# EAGLE schematic M869D (EAGLE 6.6.0)

## Sheet 1 of 2
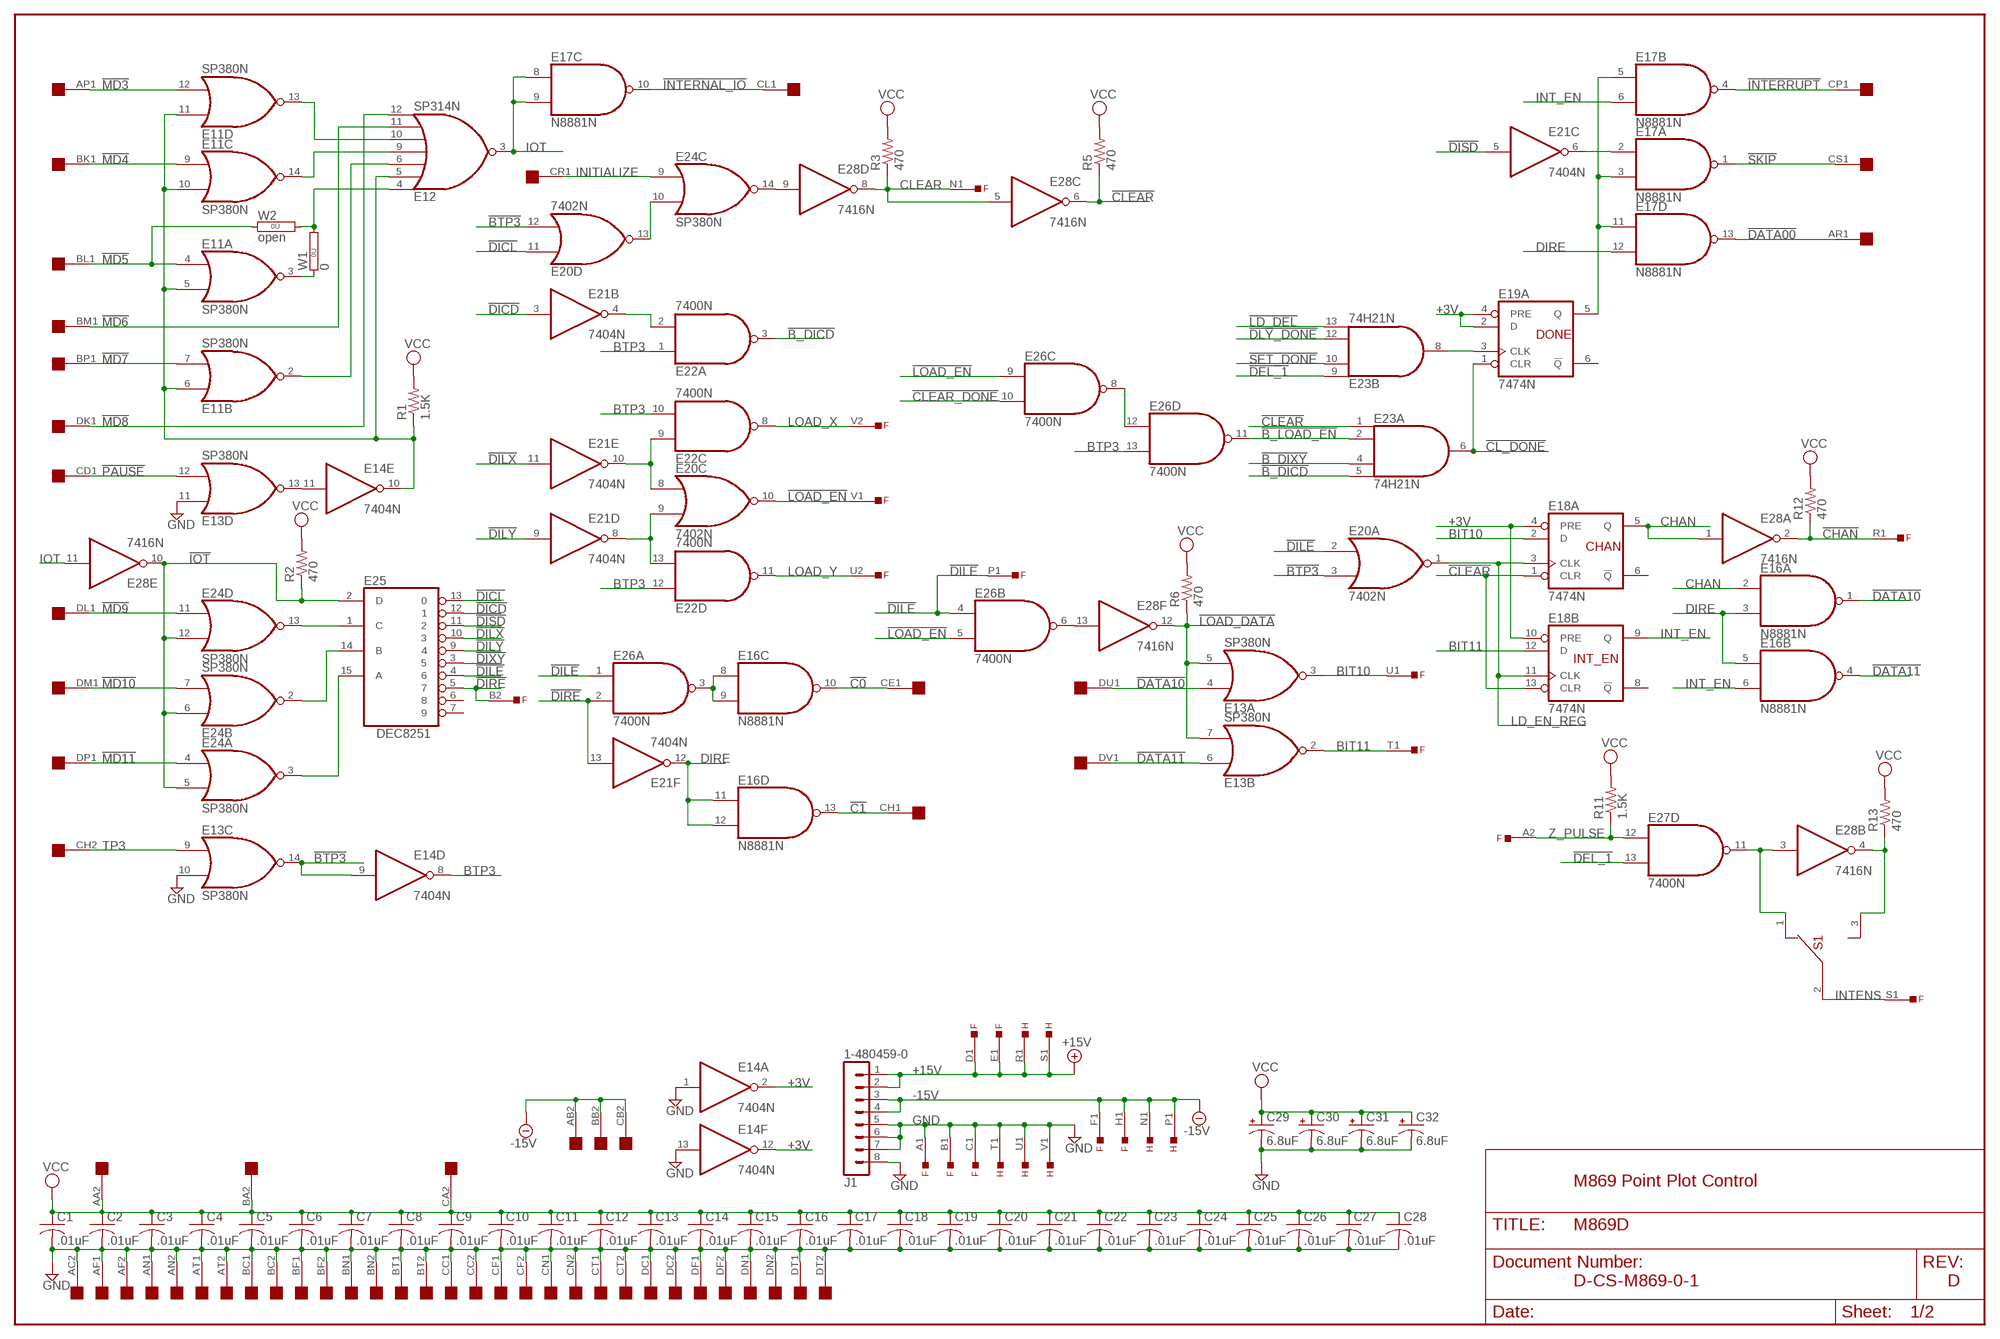
[diagram p0: schematic, sheet 1]

### Parts
C1  .01uF  C-US  [C063-025X075]
C2  .01uF  C-US  [C063-025X075]
C3  .01uF  C-US  [C063-025X075]
C4  .01uF  C-US  [C063-025X075]
C5  .01uF  C-US  [C063-025X075]
C6  .01uF  C-US  [C063-025X075]
C7  .01uF  C-US  [C063-025X075]
C8  .01uF  C-US  [C063-025X075]
C9  .01uF  C-US  [C063-025X075]
C10  .01uF  C-US  [C063-025X075]
C11  .01uF  C-US  [C063-025X075]
C12  .01uF  C-US  [C063-025X075]
C13  .01uF  C-US  [C063-025X075]
C14  .01uF  C-US  [C063-025X075]
C15  .01uF  C-US  [C063-025X075]
C16  .01uF  C-US  [C063-025X075]
C17  .01uF  C-US  [C063-025X075]
C18  .01uF  C-US  [C063-025X075]
C19  .01uF  C-US  [C063-025X075]
C20  .01uF  C-US  [C063-025X075]
C21  .01uF  C-US  [C063-025X075]
C22  .01uF  C-US  [C063-025X075]
C23  .01uF  C-US  [C063-025X075]
C24  .01uF  C-US  [C063-025X075]
C25  .01uF  C-US  [C063-025X075]
C26  .01uF  C-US  [C063-025X075]
C27  .01uF  C-US  [C063-025X075]
C28  .01uF  C-US  [C063-025X075]
C29  6.8uF  CPOL-USE20-8AXIAL  [E12-8]
C30  6.8uF  CPOL-USE20-8AXIAL  [E12-8]
C31  6.8uF  CPOL-USE20-8AXIAL  [E12-8]
C32  6.8uF  CPOL-USE20-8AXIAL  [E12-8]
E11  SP380N  [DIL14]
E12  SP314N  [DIL14]
E13  SP380N  [DIL14]
E14  7404N  [DIL14]
E16  N8881N  [DIL14]
E17  N8881N  [DIL14]
E18  7474N  74S74N  [DIL14]
E19  7474N  74S74N  [DIL14]
E20  7402N  [DIL14]
E21  7404N  [DIL14]
E22  7400N  [DIL14]
E23  74H21N  74LS21N  [DIL14]
E24  SP380N  [DIL14]
E25  DEC8251  [DIL16]
E26  7400N  [DIL14]
E27  7400N  [DIL14]
E28  7416N  [DIL14]
F  EDGE-TOP  [EDGE-CON2]
H  EDGE-TOP  [EDGE-CON2]
J1  1-480459-0  [1-480459-0]
OMNIBUS  QUAD  [EDGE-CON8]
R1  1.5K  R-US_0207/10  [0207/10]
R2  470  R-US_0207/10  [0207/10]
R3  470  R-US_0207/10  [0207/10]
R5  470  R-US_0207/10  [0207/10]
R6  470  R-US_0207/10  [0207/10]
R11  1.5K  R-US_0207/10  [0207/10]
R12  470  R-US_0207/10  [0207/10]
R13  470  R-US_0207/10  [0207/10]
S1  12-09698  [23-021]
W1  0  0R  [0R/10]
W2  open  0R  [0R/10]

### Nets
!B_DICD: E22.3(A:O) E23.5(A:I3)
!B_DIXY: E23.4(A:I2) ; also sheet 2
!B_LOAD_EN: E23.2(A:I1) E26.11(D:O)
!BTP3: E13.14(C:O) E14.9(D:I) E20.3(A:I1) E20.12(D:I1)
!C0: E16.10(C:O) OMNIBUS.CE1
!C1: E16.13(D:O) OMNIBUS.CH1
!CHAN: E28.2(A:O) F.R1 R12.1
!CL_DONE: E19.1(A:CLR) E23.6(A:O)
!CLEAR: E18.1(A:CLR) E18.13(B:CLR) E23.1(A:I0) E28.6(C:O) R5.1 ; also sheet 2
!CLEAR_DONE: E26.10(C:I1) ; also sheet 2
!DATA00: E17.13(D:O) OMNIBUS.AR1
!DATA10: E13.4(A:I0) E16.1(A:O) OMNIBUS.DU1
!DATA11: E13.6(B:I0) E16.4(B:O) OMNIBUS.DV1
!DEL_1: E23.9(B:I0) E27.13(D:I1) ; also sheet 2
!DICD: E21.3(B:I) E25.12
!DICL: E20.11(D:I0) E25.13
!DILE: E20.2(A:I0) E25.4 E26.1(A:I0) E26.4(B:I0) F.P1
!DILX: E21.11(E:I) E25.10
!DILY: E21.9(D:I) E25.9
!DIRE: E21.13(F:I) E25.5 E26.2(A:I1) F.B2
!DISD: E21.5(C:I) E25.11
!DIXY: E25.3 ; also sheet 2
!DLY_DONE: E23.12(B:I2) ; also sheet 2
!INTERNAL_IO: E17.10(C:O) OMNIBUS.CL1
!INTERRUPT: E17.4(B:O) OMNIBUS.CP1
!IOT: E24.5(A:I1) E24.6(B:I0) E24.12(D:I1) E25.2(D) E28.10(E:O) R2.1
!LD_DEL: E23.13(B:I3) ; also sheet 2
!LOAD_DATA: E13.5(A:I1) E13.7(B:I1) E28.12(F:O) R6.1 ; also sheet 2
!LOAD_EN: E20.10(C:O) E26.5(B:I1) E26.9(C:I0) F.V1 ; also sheet 2
!MD3: E11.12(D:I1) OMNIBUS.AP1
!MD4: E11.9(C:I0) OMNIBUS.BK1
!MD5: E11.4(A:I0) OMNIBUS.BL1 W2.1
!MD6: E12.11(I5) OMNIBUS.BM1
!MD7: E11.7(B:I1) OMNIBUS.BP1
!MD8: E12.12(I6) OMNIBUS.DK1
!MD9: E24.11(D:I0) OMNIBUS.DL1
!MD10: E24.7(B:I1) OMNIBUS.DM1
!MD11: E24.4(A:I0) OMNIBUS.DP1
!PAUSE: E13.12(D:I1) OMNIBUS.CD1
!SET_DONE: E23.10(B:I1) ; also sheet 2
!SKIP: E17.1(A:O) OMNIBUS.CS1
+3V: E14.2(A:O) E14.12(F:O) E18.4(A:PRE) E18.10(B:PRE) E19.2(A:D) E19.4(A:PRE) ; also sheet 2
+15V: F.D1 F.E1 H.R1 H.S1 J1.1 J1.2
-15V [supply]: F.F1 F.H1 H.N1 H.P1 J1.3 J1.4 OMNIBUS.AB2 OMNIBUS.BB2 OMNIBUS.CB2
BIT10: E13.3(A:O) E18.2(A:D) F.U1
BIT11: E13.2(B:O) E18.12(B:D) F.T1
BTP3: E14.8(D:O) E22.1(A:I0) E22.10(C:I1) E22.12(D:I0) E26.13(D:I1) ; also sheet 2
CHAN: E16.2(A:I0) E18.5(A:Q) E28.1(A:I)
CLEAR: E28.5(C:I) E28.8(D:O) F.N1 R3.1 ; also sheet 2
DEL_1: E27.11(D:O) E28.3(B:I) S1.1(A1)
DEL_1_L: E28.4(B:O) R13.1 S1.3(A3)
DICD: E21.4(B:O) E22.2(A:I1)
DILX: E20.8(C:I0) E21.10(E:O) E22.9(C:I0)
DILY: E20.9(C:I1) E21.8(D:O) E22.13(D:I1)
DIRE: E16.3(A:I1) E16.5(B:I0) E16.11(D:I0) E16.12(D:I1) E17.12(D:I1) E21.12(F:O) ; also sheet 2
DISD: E17.2(A:I0) E21.6(C:O)
GND [supply]: C1.2 C2.2 C3.2 C4.2 C5.2 C6.2 C7.2 C8.2 C9.2 C10.2 C11.2 C12.2 C13.2 C14.2 C15.2 C16.2 C17.2 C18.2 C19.2 C20.2 C21.2 C22.2 C23.2 C24.2 C25.2 C26.2 C27.2 C28.2 C29.- C30.- C31.- C32.- E13.10(C:I1) E13.11(D:I0) E14.1(A:I) E14.13(F:I) F.A1 F.B1 F.C1 H.T1 H.U1 H.V1 J1.5 J1.6 J1.7 J1.8 OMNIBUS.AC2 OMNIBUS.AF1 OMNIBUS.AF2 OMNIBUS.AN1 OMNIBUS.AN2 OMNIBUS.AT1 OMNIBUS.AT2 OMNIBUS.BC1 OMNIBUS.BC2 OMNIBUS.BF1 OMNIBUS.BF2 OMNIBUS.BN1 OMNIBUS.BN2 OMNIBUS.BT1 OMNIBUS.BT2 OMNIBUS.CC1 OMNIBUS.CC2 OMNIBUS.CF1 OMNIBUS.CF2 OMNIBUS.CN1 OMNIBUS.CN2 OMNIBUS.CT1 OMNIBUS.CT2 OMNIBUS.DC1 OMNIBUS.DC2 OMNIBUS.DF1 OMNIBUS.DF2 OMNIBUS.DN1 OMNIBUS.DN2 OMNIBUS.DT1 OMNIBUS.DT2 ; also sheet 2
INITIALIZE: E24.9(C:I0) OMNIBUS.CR1
INT_EN: E16.6(B:I1) E17.6(B:I1) E18.9(B:Q)
INTENS: F.S1 S1.2(A2)
IO3: E11.13(D:O) E12.10(I4)
IO4: E11.14(C:O) E12.9(I3)
IO5: E12.4(I0) W1.2 W2.2
IO7: E11.2(B:O) E12.6(I2)
IOT: E12.3(O) E17.8(C:I0) E17.9(C:I1) E28.11(E:I)
LD_EN_REG: E18.3(A:CLK) E18.11(B:CLK) E20.1(A:O) ; also sheet 2
LOAD_X: E22.8(C:O) F.V2
LOAD_Y: E22.11(D:O) F.U2
MD5: E11.3(A:O) W1.1
N$1: E17.3(A:I1) E17.5(B:I0) E17.11(D:I0) E19.5(A:Q)
N$2: E26.8(C:O) E26.12(D:I0)
N$3: E19.3(A:CLK) E23.8(B:O)
N$4: E16.8(C:I0) E16.9(C:I1) E26.3(A:O)
N$5: E26.6(B:O) E28.13(F:I)
N$16: E13.13(D:O) E14.11(E:I)
N$18: E24.14(C:O) E28.9(D:I)
N$19: E24.3(A:O) E25.15(A)
N$20: E24.2(B:O) E25.14(B)
N$21: E24.13(D:O) E25.1(C)
N$23: E20.13(D:O) E24.10(C:I1)
PAUSE_L: E11.5(A:I1) E11.6(B:I0) E11.10(C:I1) E11.11(D:I0) E12.5(I1) E14.10(E:O) R1.1
TP3: E13.9(C:I0) OMNIBUS.CH2
VCC [supply]: C1.1 C2.1 C3.1 C4.1 C5.1 C6.1 C7.1 C8.1 C9.1 C10.1 C11.1 C12.1 C13.1 C14.1 C15.1 C16.1 C17.1 C18.1 C19.1 C20.1 C21.1 C22.1 C23.1 C24.1 C25.1 C26.1 C27.1 C28.1 C29.+ C30.+ C31.+ C32.+ OMNIBUS.AA2 OMNIBUS.BA2 OMNIBUS.CA2 R1.2 R2.2 R3.2 R5.2 R6.2 R11.2 R12.2 R13.2 ; also sheet 2
Z_PULSE: E27.12(D:I0) F.A2 R11.1
Unconnected: E14.3(B:I) E14.4(B:O) E14.5(C:I) E14.6(C:O) E18.6(A:!Q) E18.8(B:!Q) E19.6(A:!Q) E19.8(B:!Q) E19.9(B:Q) E19.10(B:PRE) E19.11(B:CLK) E19.12(B:D) E19.13(B:CLR) E20.4(B:O) E20.5(B:I0) E20.6(B:I1) E25.6 E25.7 E27.1(A:I0) E27.2(A:I1) E27.3(A:O) E27.4(B:I0) E27.5(B:I1) E27.6(B:O) E27.8(C:O) E27.9(C:I0) E27.10(C:I1) F.E2 F.F2 F.H2 F.J1 F.J2 F.K2 F.L2 F.M2 F.N2 F.P2 F.R2 F.S2 F.T2 H.A1 H.A2 H.B1 H.B2 H.C1 H.C2 H.D1 H.D2 H.E1 H.E2 H.F1 H.F2 H.H1 H.H2 H.J1 H.J2 H.K1 H.K2 H.L1 H.L2 H.M1 H.M2 H.N2 H.P2 H.R2 H.S2 H.T2 H.U2 H.V2 OMNIBUS.AA1 OMNIBUS.AB1 OMNIBUS.AC1 OMNIBUS.AD1 OMNIBUS.AD2 OMNIBUS.AE1 OMNIBUS.AE2 OMNIBUS.AH1 OMNIBUS.AH2 OMNIBUS.AJ1 OMNIBUS.AJ2 OMNIBUS.AK1 OMNIBUS.AK2 OMNIBUS.AL1 OMNIBUS.AL2 OMNIBUS.AM1 OMNIBUS.AM2 OMNIBUS.AP2 OMNIBUS.AR2 OMNIBUS.AS1 OMNIBUS.AS2 OMNIBUS.AU1 OMNIBUS.AU2 OMNIBUS.AV1 OMNIBUS.AV2 OMNIBUS.BA1 OMNIBUS.BB1 OMNIBUS.BD1 OMNIBUS.BD2 OMNIBUS.BE1 OMNIBUS.BE2 OMNIBUS.BH1 OMNIBUS.BH2 OMNIBUS.BJ1 OMNIBUS.BJ2 OMNIBUS.BK2 OMNIBUS.BL2 OMNIBUS.BM2 OMNIBUS.BP2 OMNIBUS.BR1 OMNIBUS.BR2 OMNIBUS.BS1 OMNIBUS.BS2 OMNIBUS.BU2 OMNIBUS.BV2 OMNIBUS.CA1 OMNIBUS.CB1 OMNIBUS.CD2 OMNIBUS.CE2 OMNIBUS.CJ1 OMNIBUS.CJ2 OMNIBUS.CK1 OMNIBUS.CK2 OMNIBUS.CL2 OMNIBUS.CM1 OMNIBUS.CM2 OMNIBUS.CP2 OMNIBUS.CR2 OMNIBUS.CS2 OMNIBUS.CU1 OMNIBUS.CU2 OMNIBUS.CV1 OMNIBUS.CV2 OMNIBUS.DA1 OMNIBUS.DA2 OMNIBUS.DB1 OMNIBUS.DB2 OMNIBUS.DD1 OMNIBUS.DD2 OMNIBUS.DE1 OMNIBUS.DE2 OMNIBUS.DH1 OMNIBUS.DH2 OMNIBUS.DJ1 OMNIBUS.DJ2 OMNIBUS.DK2 OMNIBUS.DL2 OMNIBUS.DM2 OMNIBUS.DP2 OMNIBUS.DR2 OMNIBUS.DS2 OMNIBUS.DU2 OMNIBUS.DV2

### Notes on the sheet
- DONE
- CHAN
- INT_EN
- M869 Point Plot Control
- D-CS-M869-0-1 | D

## Sheet 2 of 2
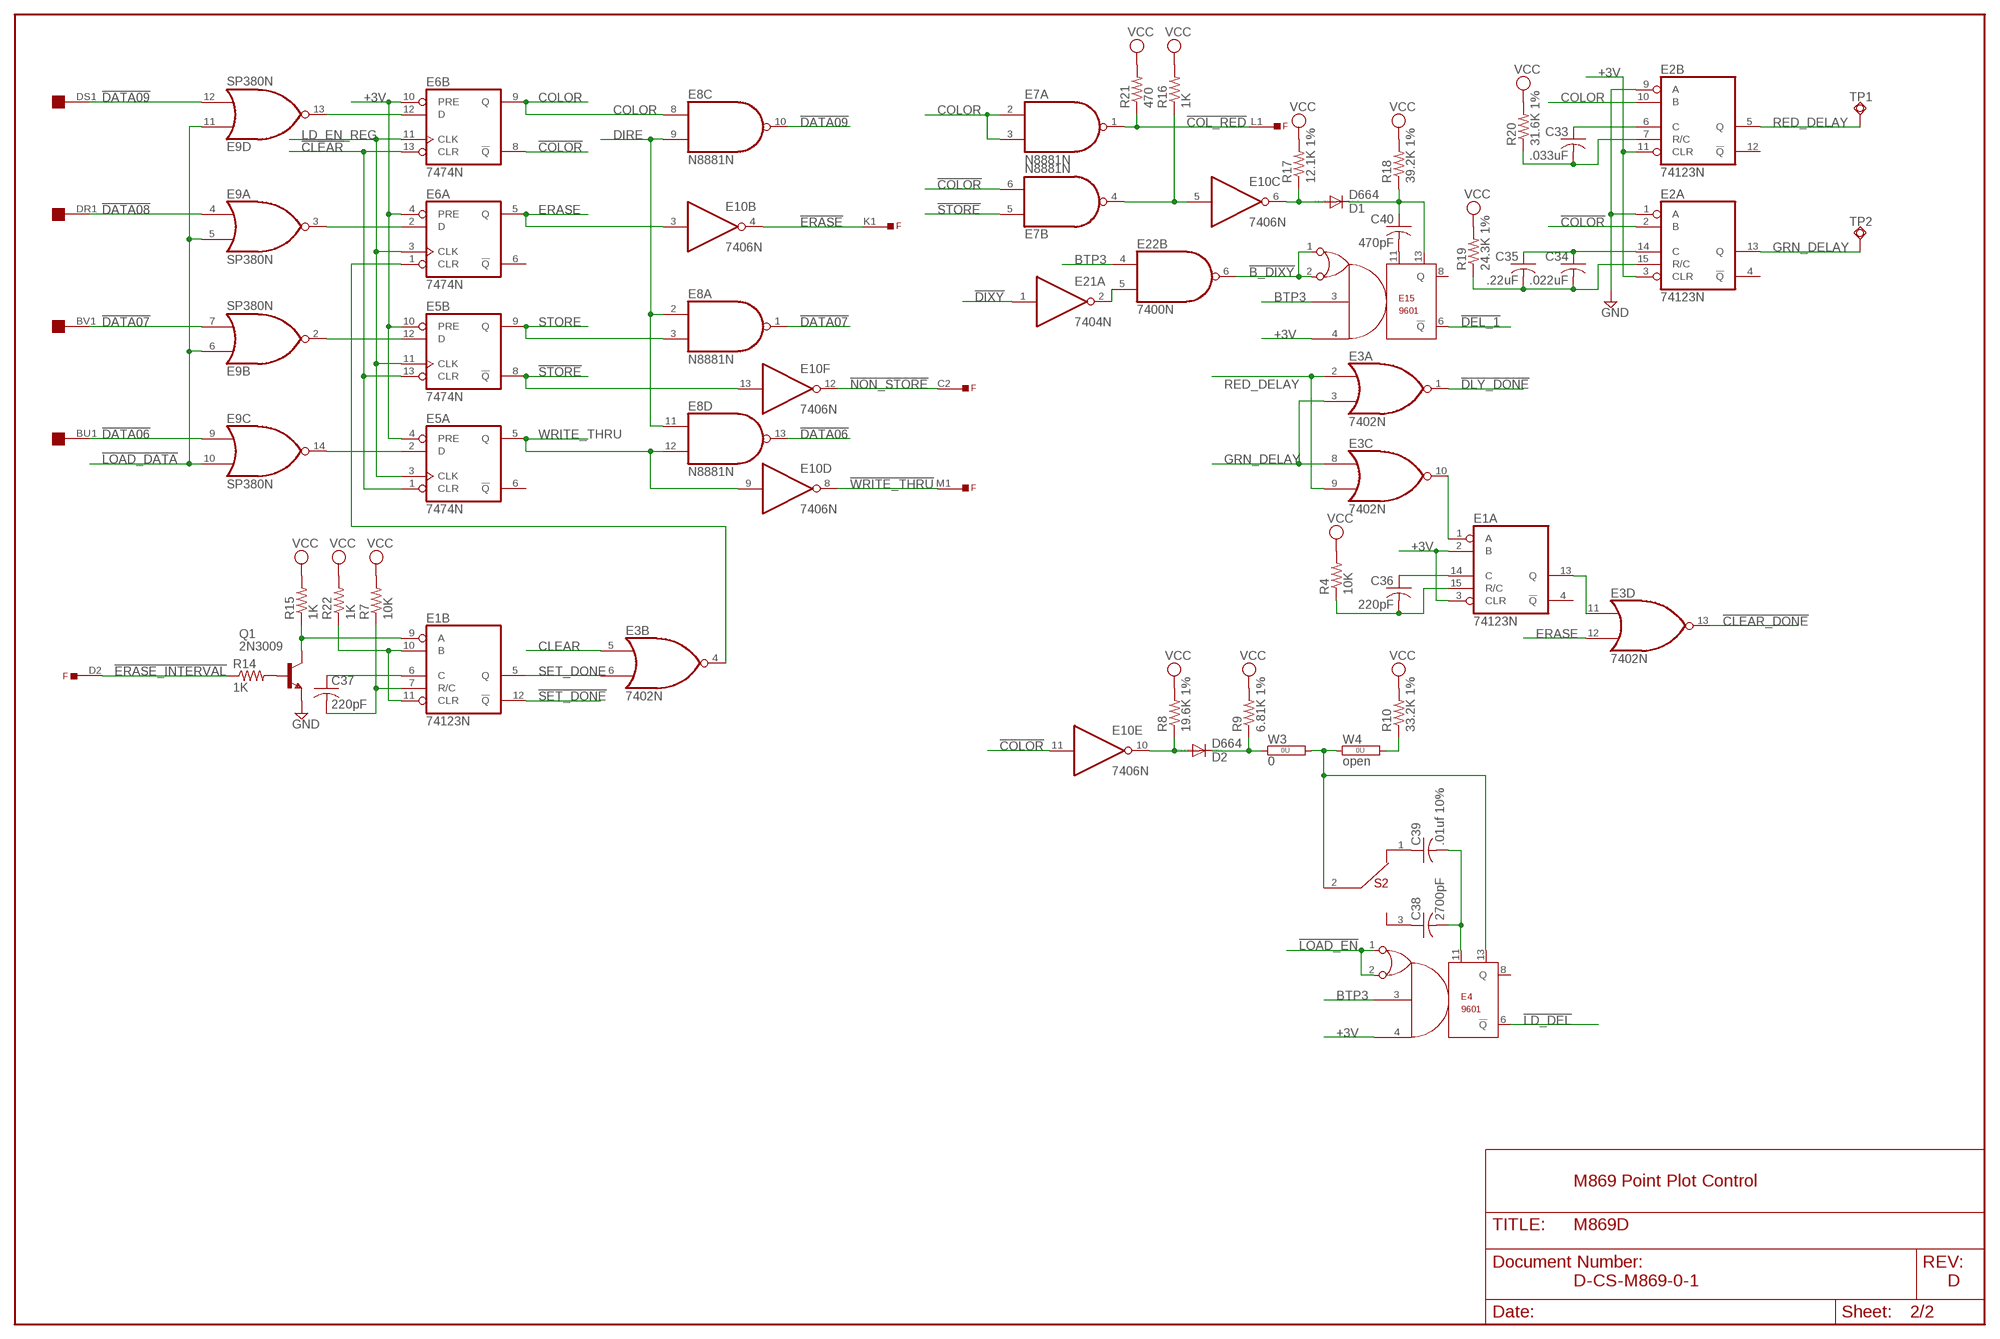
[diagram p1: schematic, sheet 2]

### Parts
C33  .033uF  C-US325-137X374  [C325-137X374]
C34  .022uF  C-US8  [C203-054-229]
C35  .22uF  C-US8  [C203-054-229]
C36  220pF  C-US  [C063-025X075]
C37  220pF  C-US  [C063-025X075]
C38  2700pF  C-US102-043X133  [C102-043X133]
C39  .01uf 10%  C-US  [C063-025X075]
C40  470pF  C-US  [C063-025X075]
D1  D664  DIODE-DO35-10  [DO35-10]
D2  D664  DIODE-DO35-10  [DO35-10]
E1  74123N  [DIL16]
E2  74123N  [DIL16]
E3  7402N  [DIL14]
E4  9601  [DIL14]
E5  7474N  74S74N  [DIL14]
E6  7474N  74S74N  [DIL14]
E7  N8881N  [DIL14]
E8  N8881N  [DIL14]
E9  SP380N  [DIL14]
E10  7406N  [DIL14]
E15  9601  [DIL14]
Q1  2N3009  -NPN-TO18-  [TO18-]
R4  10K  R-US_0207/10  [0207/10]
R7  10K  R-US_0207/10  [0207/10]
R8  19.6K 1%  R-US_0207/15  [0207/15]
R9  6.81K 1%  R-US_0207/15  [0207/15]
R10  33.2K 1%  R-US_0207/15  [0207/15]
R14  1K  R-US_0207/10  [0207/10]
R15  1K  R-US_0207/10  [0207/10]
R16  1K  R-US_0207/10  [0207/10]
R17  12.1K 1%  R-US_0207/15  [0207/15]
R18  39.2K 1%  R-US_0207/15  [0207/15]
R19  24.3K 1%  R-US_0207/15  [0207/15]
R20  31.6K 1%  R-US_0207/15  [0207/15]
R21  470  R-US_0207/10  [0207/10]
R22  1K  R-US_0207/10  [0207/10]
S2  12-09698  [23-021]
TP1  TPSQPAD1-17  [P1-17]
TP2  TPSQPAD1-17  [P1-17]
W3  0  0R  [0R/10]
W4  open  0R  [0R/10]

### Nets
!B_DIXY: E15.1 E15.2 E22.6(B:O) ; also sheet 1
!CLEAR: E5.1(A:CLR) E5.13(B:CLR) E6.13(B:CLR) ; also sheet 1
!CLEAR_DONE: E3.13(D:O) ; also sheet 1
!COL_RED: E7.1(A:O) F.L1 R21.1
!COLOR: E2.2(A:B) E6.8(B:!Q) E7.6(B:I1) E10.11(E:I)
!DATA06: E8.13(D:O) E9.9(C:I0) OMNIBUS.BU1
!DATA07: E8.1(A:O) E9.7(B:I1) OMNIBUS.BV1
!DATA08: E9.4(A:I0) OMNIBUS.DR1
!DATA09: E8.10(C:O) E9.12(D:I1) OMNIBUS.DS1
!DEL_1: E15.6(!Q) ; also sheet 1
!DIXY: E21.1(A:I) ; also sheet 1
!DLY_DONE: E3.1(A:O) ; also sheet 1
!ERASE: E10.4(B:O) F.K1
!ERASE_INTERVAL: F.D2 R14.1
!GREEN: D1.A E10.6(C:O) R17.1
!LD_DEL: E4.6(!Q) ; also sheet 1
!LOAD_DATA: E9.5(A:I1) E9.6(B:I0) E9.10(C:I1) E9.11(D:I0) ; also sheet 1
!LOAD_EN: E4.1 E4.2 ; also sheet 1
!NON_STORE: E10.12(F:O) F.C2
!SET_DONE: E1.12(B:!Q) ; also sheet 1
!STORE: E5.8(B:!Q) E7.5(B:I0) E10.13(F:I)
!WRITE_THRU: E10.8(D:O) F.M1
+3V: E1.2(A:B) E1.3(A:CLR) E2.3(A:CLR) E2.11(B:CLR) E4.4 E5.4(A:PRE) E5.10(B:PRE) E6.4(A:PRE) E6.10(B:PRE) E15.4 ; also sheet 1
BCOLOR: D2.A E10.10(E:O) R8.1
BTP3: E4.3 E15.3 E22.4(B:I0) ; also sheet 1
CLEAR: E3.5(B:I0) ; also sheet 1
COLOR: E2.10(B:B) E6.9(B:Q) E7.2(A:I0) E7.3(A:I1) E8.8(C:I0)
DDONE: E1.13(A:Q) E3.11(D:I0)
DIRE: E8.2(A:I0) E8.9(C:I1) E8.11(D:I0) ; also sheet 1
DLY_DONE_L: E1.1(A:A) E3.10(C:O)
ERASE: E3.12(D:I1) E6.5(A:Q) E10.3(B:I)
GND [supply]: E2.1(A:A) E2.9(B:A) Q1.1(E) ; also sheet 1
GRN_DELAY: E2.13(A:Q) E3.3(A:I1) E3.8(C:I0) TP2.TP
LD_EN_REG: E5.3(A:CLK) E5.11(B:CLK) E6.3(A:CLK) E6.11(B:CLK) ; also sheet 1
N$7: E21.2(A:O) E22.5(B:I1)
N$11: E6.12(B:D) E9.13(D:O)
N$13: E5.2(A:D) E9.14(C:O)
N$22: E5.12(B:D) E9.2(B:O)
N$24: E6.2(A:D) E9.3(A:O)
N$25: E7.4(B:O) E10.5(C:I) R16.1
N$26: E3.4(B:O) E6.1(A:CLR)
N$28: C40.1 D1.C E15.13 R18.1
N$29: C40.2 E15.11
N$30: C34.2 C35.2 E2.15(A:R/C) R19.1
N$31: C33.2 E2.7(B:R/C) R20.1
N$32: C33.1 E2.6(B:C)
N$33: C34.1 C35.1 E2.14(A:C)
N$36: C36.2 E1.15(A:R/C) R4.1
N$37: C36.1 E1.14(A:C)
N$38: Q1.2(B) R14.2
N$39: E1.9(B:A) Q1.3(C) R15.1
N$40: E1.10(B:B) E1.11(B:CLR) R22.1
N$41: C37.2 E1.7(B:R/C) R7.1
N$42: C37.1 E1.6(B:C)
N$44: D2.C R9.1 W3.1
N$45: E4.13 S2.2(A2) W3.2 W4.1
N$46: R10.1 W4.2
N$47: C39.1 S2.1(A1)
N$48: C38.1 S2.3(A3)
N$49: C38.2 C39.2 E4.11
RED_DELAY: E2.5(B:Q) E3.2(A:I0) E3.9(C:I1) TP1.TP
SET_DONE: E1.5(B:Q) E3.6(B:I1)
STORE: E5.9(B:Q) E8.3(A:I1)
VCC [supply]: R4.2 R7.2 R8.2 R9.2 R10.2 R15.2 R16.2 R17.2 R18.2 R19.2 R20.2 R21.2 R22.2 ; also sheet 1
WRITE_THRU: E5.5(A:Q) E8.12(D:I1) E10.9(D:I)
Unconnected: E1.4(A:!Q) E2.4(A:!Q) E2.12(B:!Q) E4.8(Q) E5.6(A:!Q) E6.6(A:!Q) E7.8(C:I0) E7.9(C:I1) E7.10(C:O) E7.11(D:I0) E7.12(D:I1) E7.13(D:O) E8.4(B:O) E8.5(B:I0) E8.6(B:I1) E10.1(A:I) E10.2(A:O) E15.8(Q)

### Notes on the sheet
- M869 Point Plot Control
- D-CS-M869-0-1 | D

## Power pins joined to a net without a drawn wire
GND: E1.8(P:GND) E2.8(P:GND) E3.7(P:GND) E4.7(GND) E5.7(P:GND) E6.7(P:GND) E7.7(P:GND) E8.7(P:GND) E9.1(P:GND) E10.7(P:GND) E11.1(P:GND) E12.1(GND) E13.1(P:GND) E14.7(P:GND) E15.7(GND) E16.7(P:GND) E17.7(P:GND) E18.7(P:GND) E19.7(P:GND) E20.7(P:GND) E21.7(P:GND) E22.7(P:GND) E23.7(P:GND) E24.1(P:GND) E25.8(GND) E26.7(P:GND) E27.7(P:GND) E28.7(P:GND)
VCC: E1.16(P:VCC) E2.16(P:VCC) E3.14(P:VCC) E4.14(VCC) E5.14(P:VCC) E6.14(P:VCC) E7.14(P:VCC) E8.14(P:VCC) E9.8(P:VCC) E10.14(P:VCC) E11.8(P:VCC) E12.8(VCC) E13.8(P:VCC) E14.14(P:VCC) E15.14(VCC) E16.14(P:VCC) E17.14(P:VCC) E18.14(P:VCC) E19.14(P:VCC) E20.14(P:VCC) E21.14(P:VCC) E22.14(P:VCC) E23.14(P:VCC) E24.8(P:VCC) E25.16(VCC) E26.14(P:VCC) E27.14(P:VCC) E28.14(P:VCC)

## Library data of the parts
C1-C28 C34-C37 C39 C40 = dec-con:C-US: Capacitors with funky DEC lead spacing.
C29-C32 = dec-con:CPOL-USE20-8AXIAL: A 0.8 inch electrolytic.
C33 C38 = rcl:C-US: CAPACITOR, American symbol
D1 D2 = diode:DIODE-: DIODE
E1 E2 = 74xx-us:74*123: Retriggerable monostable MULTIVIBRATOR
E3 E20 = 74xx-us:74*02: Quad 2-input NOR gate
E4 E15 = dec-con:9601: DEC9601 monstable
E5 E6 E18 E19 = 74xx-us:74*74: Dual D type positive edge triggered FLIP FLOP, preset and clear
E7 E8 E16 E17 = dec-con:N8881: Quad 2-input NAND gate, open collector
E9 E11 E13 E24 = dec-con:SP380: Quad NOR gate (use 8640)
E10 = 74xx-us:74*06: Hex INVERTER, open collector high-voltage output
E12 = dec-con:SP314: 7-Input NOR gate
E14 E21 = 74xx-us:74*04: Hex INVERTER
E22 E26 E27 = 74xx-us:74*00: Quad 2-input NAND gate
E23 = 74xx-us:74*21: Dual 4-input AND gate
E25 = dec-con:DEC8251: BCD Decoder
E28 = 74xx-us:74*16: Hex INVERTER, open collector, high-voltage
F H = dec-con:EDGE-TOP: Labeled DEC edge connector, suitable for top connector.
J1 = dec-con:1-480459-0: Mate-N-Lok 1-480459-0, board mounted.
OMNIBUS = dec-con:QUAD: Quad-Height DEC board
Q1 = transistor:*-NPN-: NPN Transistror BF959 corrected 2008.03.06
R1-R22 = rcl:R-US_: RESISTOR, American symbol
S1 S2 = dec-con:12-09698: 12-09698 Slide Switch
TP1 TP2 = testpad:TPSQ: Test pad
W1-W4 = jumper:0R: Bridge 0R 10mm

## Net classes
1 supply: width 0.813 mm